# Altium schematic sheet Main_Board_rev3.SchDoc
size A; SheetNumber: 4; SheetTotal: 4
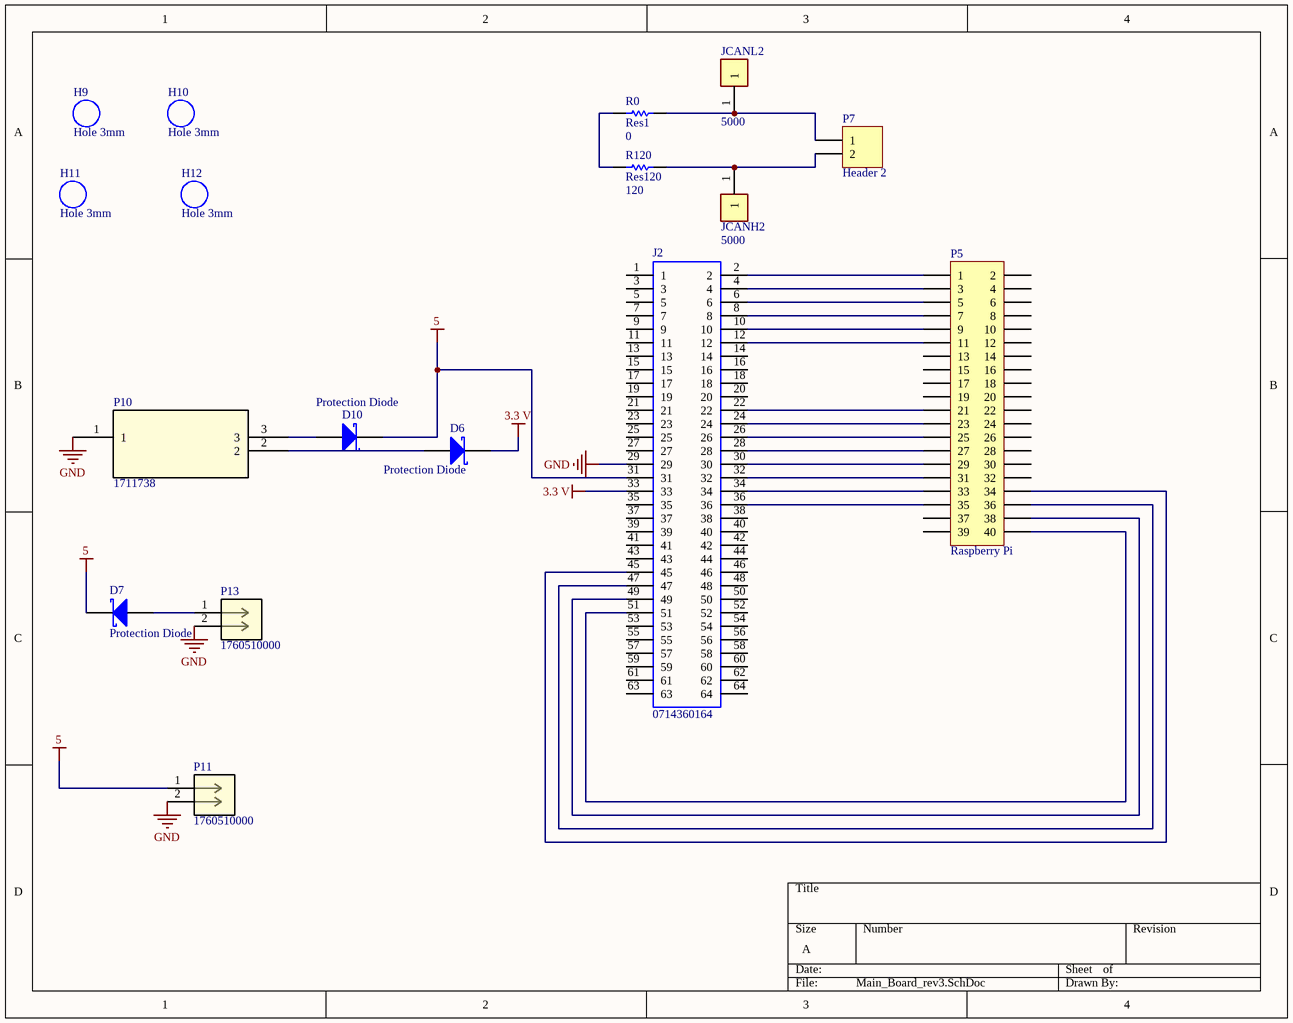
[diagram p0: Main_Board_rev3.SchDoc]

## Parts
D6  Protection Diode  [TO-220AC]
D7  Protection Diode  [TO-220AC]
D10  Protection Diode  [TO-220AC]
H9  Hole 3mm  [Hole 3mm]
H10  Hole 3mm  [Hole 3mm]
H11  Hole 3mm  [Hole 3mm]
H12  Hole 3mm  [Hole 3mm]
J2  0714360164  [0714360164]
JCANH2  5000  [KEYSTONE_5000]
JCANL2  5000  [KEYSTONE_5000]
P5  Raspberry Pi  [HDR2X20]
P7  Header 2  [HDR1X2]
P10  1711738  [1711738_PXC]
P11  1760510000  [CONN2_1760510000_WED]
P13  1760510000  [CONN2_1760510000_WED]
R0  Res1  value 0  [AXIAL-0.3]
R120  Res120  value 120  [AXIAL-0.3]

## Nets
3.3 V: D6.1(K) J2.33
5: D7.1(K) D10.1(K) J2.31 P11.1
GND: J2.29 P10.1 P11.2 P13.2
NetD6_3: D6.3(A) P10.2
NetD7_3: D7.3(A) P13.1
NetD10_3: D10.3(A) P10.3
NetJ2_2: J2.2 P5.1
NetJ2_4: J2.4 P5.3
NetJ2_6: J2.6 P5.5
NetJ2_8: J2.8 P5.7
NetJ2_10: J2.10 P5.9
NetJ2_12: J2.12 P5.11
NetJ2_22: J2.22 P5.21
NetJ2_24: J2.24 P5.23
NetJ2_26: J2.26 P5.25
NetJ2_28: J2.28 P5.27
NetJ2_30: J2.30 P5.29
NetJ2_32: J2.32 P5.31
NetJ2_34: J2.34 P5.33
NetJ2_36: J2.36 P5.35
NetJ2_45: J2.45 P5.34
NetJ2_47: J2.47 P5.36
NetJ2_49: J2.49 P5.38
NetJ2_51: J2.51 P5.40
NetJCANH2_1: JCANH2.1 P7.2 R120.2
NetJCANL2_1: JCANL2.1 P7.1 R0.2
NetR0_1: R0.1 R120.1

Not connected (* = marked no-connect by the designer): J2 1 3 5 7 9 11 13 14 15 16 17 18 19 20 21 23 25 27 35 37 38 39 40 41 42 43 44 46 48 50 52 53 54 55 56 57 58 59 60 61 62 63 64; P5 2 4 6 8 10 12 13 14 15 16 17 18 19 20 22 24 26 28 30 32 37 39

## Library data of the parts
D6 D7 D10 = Diode 10TQ035: Schottky Rectifier; Note: Terminal 2 is the TAB and is electrically connected to the cathode; Published: 8-Jun-2000; LatestRevisionDate: 17-Jul-2002; LatestRevisionNote: Re-released for DXP Platform.; DatasheetVersion: PD-2.057B; PackageVersion: Feb-1998; PackageReference: TO-220AC; Publisher: Altium Limited; PackageDescription: TO, Thru-Hole, Vertical, Heatsink Mounted; 3 In-Line Leads (1 Absent); Pitch 2.54 mm; ComponentLink1Description: Manufacturer Link; ComponentLink1URL: http://www.irf.com/; ComponentLink2Description: Datasheet; ComponentLink2URL: http://www.irf.com/product-info/datasheets/data/10tq.pdf
J2 = 0714360164: Board to Board & Mezzanine Connectors 1.00MM PLG 02X32P VT SMT; Manufacturer_Name: Molex; Geometry.Height: 7.48mm; Manufacturer_Part_Number: 0714360164; Mouser Part Number: N/A; Mouser Price/Stock: https://www.mouser.com/Search/Refine.aspx?Keyword=N%2FA; Arrow Part Number: 0714360164; Arrow Price/Stock: https://www.arrow.com/en/products/0714360164/molex; Mouser Testing Part Number: *; Mouser Testing Price/Stock: *; Datasheet Link: https://www.molex.com/pdm_docs/sd/714360164_sd.pdf
JCANH2 JCANL2 = 5000: MF: Keystone; MP: 5000; Package: Custom Package Ohmite; Availability: Good; Price: None; Purchase-URL: https://pricing.snapeda.com/search/part/5000/?ref=eda; SnapEDA_Link: https://www.snapeda.com/parts/5000/Keystone/view-part/883846/?ref=snap; Value: *
P5 = Header 20X2: Header, 20-Pin, Dual row; LatestRevisionDate: 17-Jul-2002; LatestRevisionNote: Re-released for DXP Platform.; Publisher: Altium Limited
P7 = Header 2: Header, 2-Pin; LatestRevisionDate: 17-Jul-2002; LatestRevisionNote: Re-released for DXP Platform.; Publisher: Altium Limited
P10 = 1711738: No Description Available; Mfr_Name: Phoenix Contact; Copyright: Copyright (C) 2022 Ultra Librarian. All rights reserved.; Manufacturer_Part_Number: 1711738; Digi-Key_Part_Number_1: 277-1028-ND; RefDes: RefDes; Type: DEV
P11 P13 = 1760510000: No Description Available; Mfr_Name: Weidmuller; Copyright: Copyright (C) 2022 Ultra Librarian. All rights reserved.; Manufacturer_Part_Number: 1760510000; Digi-Key_Part_Number_1: 281-1882-ND; RefDes: RefDes; Type: DEV
R0 R120 = Res1: Resistor; Published: 8-Jun-2000; LatestRevisionDate: 17-Jul-2002; LatestRevisionNote: Re-released for DXP Platform.; PackageReference: AXIAL-0.3; Publisher: Altium Limited; PackageDescription: Axial Device, Thru-Hole; 2 Leads; 0.3 in Pin Spacing